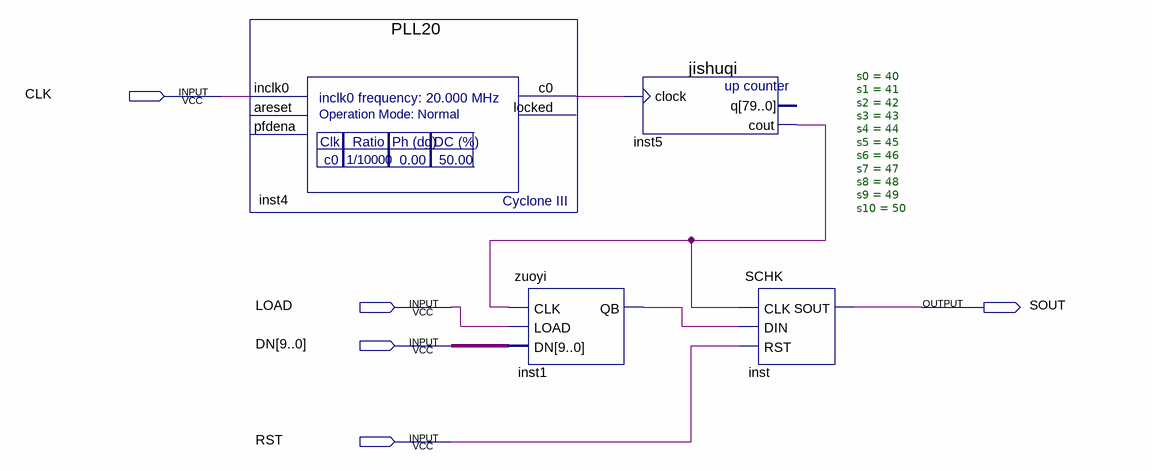
[diagram p0: schematic sheet]
// Quartus schematic zonghe.bdf as structural Verilog: 4 symbols, 5 pins
module zonghe (
  input  CLK,
  input  LOAD,
  input  [9:0] DN,
  input  RST,
  output SOUT
);

  wire inst1_qb, inst4_c0, inst5_cout;

  PLL20 inst4 (.inclk0(CLK), .c0(inst4_c0));  // open: areset, pfdena, locked
  zuoyi inst1 (.CLK(inst5_cout), .LOAD(LOAD), .DN(DN), .QB(inst1_qb));
  jishuqi inst5 (.clock(inst4_c0), .cout(inst5_cout));  // open: q
  SCHK #(.s0(40), .s1(41), .s2(42), .s3(43), .s4(44), .s5(45), .s6(46), .s7(47), .s8(48), .s9(49), .s10(50)) inst (
    .CLK(inst5_cout), .DIN(inst1_qb), .RST(RST), .SOUT(SOUT));
endmodule
